# EAGLE design pic_can_x10 (EAGLE 6.5.0)
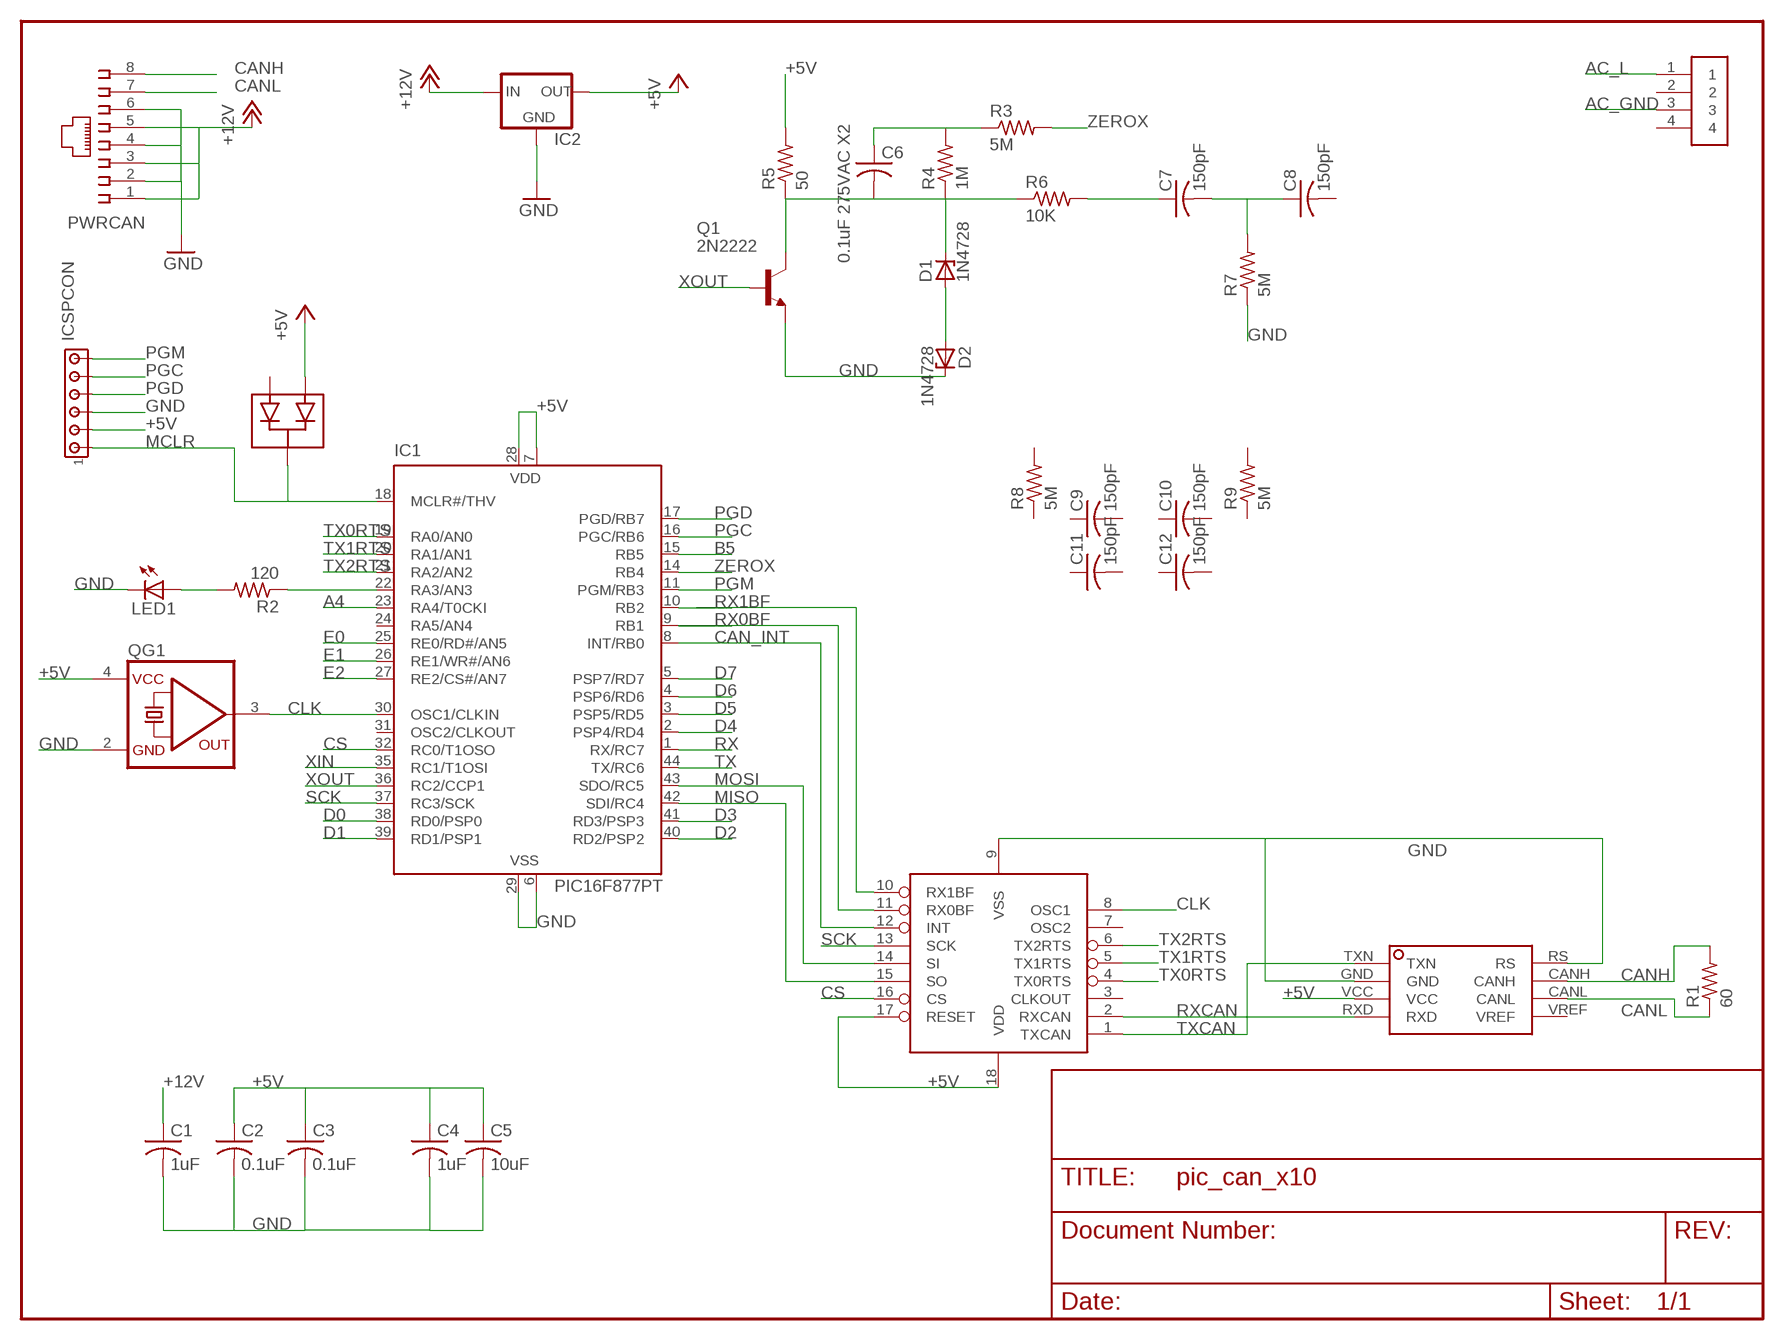
[diagram p0: schematic, sheet 1]

## Parts
C1  1uF  C-USC0805  [C0805]
C2  0.1uF  C-USC0805  [C0805]
C3  0.1uF  C-USC0805  [C0805]
C4  1uF  C-USC0805  [C0805]
C5  10uF  C-USC1206  [C1206]
C6  0.1uF 275VAC X2  C-USC0805  [C0805]
C7  150pF  C-USC0805  [C0805]
C8  150pF  C-USC0805  [C0805]
C9  150pF  C-USC0805  [C0805]
C10  150pF  C-USC0805  [C0805]
C11  150pF  C-USC0805  [C0805]
C12  150pF  C-USC0805  [C0805]
D1  1N4728  [DO41Z10]
D2  1N4728  [DO41Z10]
IC1  PIC16F877PT  [TQFP44]
IC2  78XXL  [78XXL]
IC3  UC5350D  [SOIC8]
ICSPCON  MTA06-100  [10X06MTA]
LED1  LEDCHIPLED_0805  [CHIPLED_0805]
MCP1  MCP2510-I/SO  [SO-18W]
PWRCAN  555166-1  [555166-1]
Q1  2N2222  [TO18]
QG1  SG531  [DIL08-4]
R1  60  R-US_R0805  [R0805]
R2  120  R-US_R0805  [R0805]
R3  5M  R-US_R0805  [R0805]
R4  1M  R-US_R0805  [R0805]
R5  50  R-US_R0805  [R0805]
R6  10K  R-US_R0805  [R0805]
R7  5M  R-US_R0805  [R0805]
R8  5M  R-US_R0805  [R0805]
R9  5M  R-US_R0805  [R0805]
U$1  MPT0.5/4-2.54"  [MPT0.5/4-2.54]
U$2  BAV70_  [SOT-23]

## Nets
+5V: C2.1 C3.1 C4.1 C5.1 IC1.7(VDD) IC1.28(VDD) IC2.OUT IC3.VCC ICSPCON.5 MCP1.17(RESET) MCP1.18(VDD) QG1.4(VCC) R5.2 U$2.1(A1)
+12V: C1.1 IC2.IN PWRCAN.1 PWRCAN.3 PWRCAN.5
A4: IC1.23(RA4/T0CKI)
AC_GND: U$1.3
AC_L: C6.1 R3.1 R4.2 U$1.1
B5: IC1.15(RB5)
CAN_INT: IC1.8(INT/RB0) MCP1.12(INT)
CANH: IC3.CANH PWRCAN.8 R1.2
CANL: IC3.CANL PWRCAN.7 R1.1
CLK: IC1.30(OSC1/CLKIN) MCP1.8(OSC1) QG1.3(OUT)
CS: IC1.32(RC0/T1OSO) MCP1.16(CS)
D0: IC1.38(RD0/PSP0)
D1: IC1.39(RD1/PSP1)
D2: IC1.40(RD2/PSP2)
D3: IC1.41(RD3/PSP3)
D4: IC1.2(PSP4/RD4)
D5: IC1.3(PSP5/RD5)
D6: IC1.4(PSP6/RD6)
D7: IC1.5(PSP7/RD7)
E0: IC1.25(RE0/RD#/AN5)
E1: IC1.26(RE1/WR#/AN6)
E2: IC1.27(RE2/CS#/AN7)
GND: C1.2 C2.2 C3.2 C4.2 C5.2 D2.C IC1.6(VSS) IC1.29(VSS) IC2.GND IC3.GND IC3.RS ICSPCON.4 LED1.C MCP1.9(VSS) PWRCAN.2 PWRCAN.4 PWRCAN.6 Q1.1(E) QG1.2(GND) R7.1
MCLR: IC1.18(MCLR#/THV) ICSPCON.6 U$2.3(C)
MISO: IC1.42(SDI/RC4) MCP1.15(SO)
MOSI: IC1.43(SDO/RC5) MCP1.14(SI)
N$1: LED1.A R2.2
N$2: C6.2 D1.C Q1.3(C) R4.1 R5.1 R6.1
N$3: IC1.22(RA3/AN3) R2.1
N$4: C7.1 R6.2
N$5: D1.A D2.A
N$6: C7.2 C8.1 R7.2
PGC: IC1.16(PGC/RB6) ICSPCON.2
PGD: IC1.17(PGD/RB7) ICSPCON.3
PGM: IC1.11(PGM/RB3) ICSPCON.1
RX: IC1.1(RX/RC7)
RX0BF: IC1.9(RB1) MCP1.11(RX0BF)
RX1BF: IC1.10(RB2) MCP1.10(RX1BF)
RXCAN: IC3.RXD MCP1.2(RXCAN)
SCK: IC1.37(RC3/SCK) MCP1.13(SCK)
TX: IC1.44(TX/RC6)
TX0RTS: IC1.19(RA0/AN0) MCP1.4(TX0RTS)
TX1RTS: IC1.20(RA1/AN1) MCP1.5(TX1RTS)
TX2RTS: IC1.21(RA2/AN2) MCP1.6(TX2RTS)
TXCAN: IC3.TXN MCP1.1(TXCAN)
XIN: IC1.35(RC1/T1OSI)
XOUT: IC1.36(RC2/CCP1) Q1.2(B)
ZEROX: IC1.14(RB4) R3.2
Unconnected: C8.2 C9.1 C9.2 C10.1 C10.2 C11.1 C11.2 C12.1 C12.2 IC1.24(RA5/AN4) IC1.31(OSC2/CLKOUT) IC3.VREF MCP1.3(CLKOUT) MCP1.7(OSC2) R8.1 R8.2 R9.1 R9.2 U$1.2 U$1.4 U$2.2(A2)

## Library data of the parts
C1-C12 = rcl:C-US: CAPACITOR, American symbol
D1 D2 = diode:1N4728: Z DIODE 3.3 V, 1W, 5 percent
IC1 = microchip:PIC16F87*: MICROCONTROLLER
IC2 = v-reg:78XXL: VOLTAGE REGULATOR
IC3 = house:UC5350: CAN Tranceiver
ICSPCON = con-amp:MTA06-100: AMP CONNECTOR
LED1 = led:LED: LED OSRAM: - CHIPLED LG R971, LG N971, LY N971, LG Q971, LY Q971, LO R971, LY R971 LH N974, LH R974 LS Q976, LO Q976, LY Q976 LO Q996 - Hyper CHIPLED LW Q18S LB Q993, LB Q99A, LB R99A - SideLED LS A670, LO A670, LY A670, LG A670, LP A670 LB A673, LV A673, LT A673, LW A673 LH A674 LY A675 LS A676, LA A676, LO A676, LY A676, LW A676 LS A679, LY A679, LG A679 - Hyper Micro SIDELED® LS Y876, LA Y876, LO Y876, LY Y876 LT Y87S - SmartLED LW L88C, LW L88S LB L89C, LB L89S, LG L890 LS L89K, LO L89K, LY L89K LS L896, LA L896, LO L896, LY L896 - TOPLED LS T670, LO T670, LY T670, LG T670, LP T670 LSG T670, LSP T670, LSY T670, LOP T670, LYG T670 LG T671, LOG T671, LSG T671 LB T673, LV T673, LT T673, LW T673 LH T674 LS T676, LA T676, LO T676, LY T676, LB T676, LH T676, LSB T676, LW T676 LB T67C, LV T67C, LT T67C, LS T67K, LO T67K, LY T67K, LW E67C LS E67B, LA E67B, LO E67B, LY E67B, LB E67C, LV E67C, LT E67C LW T67C LS T679, LY T679, LG T679 LS T770, LO T770, LY T770, LG T770, LP T770 LB T773, LV T773, LT T773, LW T773 LH T774 LS E675, LA E675, LY E675, LS T675 LS T776, LA T776, LO T776, LY T776, LB T776 LHGB T686 LT T68C, LB T68C - Hyper Mini TOPLED® LB M676 - Mini TOPLED Santana® LG M470 LS M47K, LO M47K, LY M47K Source: http://www.osram.convergy.de/
MCP1 = microchip:MCP2510
PWRCAN = con-amp:555166-1: AMP connector
Q1 = transistor-npn:2N2222*: NPN Transistor
QG1 = crystal:SG531: CRYSTAL RESONATOR
R1-R9 = rcl:R-US_: RESISTOR, American symbol
U$1 = house:MPT0.5/4-2.54: Pheonix Contact Micro-Pitch Terminal Block
U$2 = house:BAV70: Fairchild Semiconductor Small Signal, Dual, Common Cathode, SOT-23 Diode

## Board
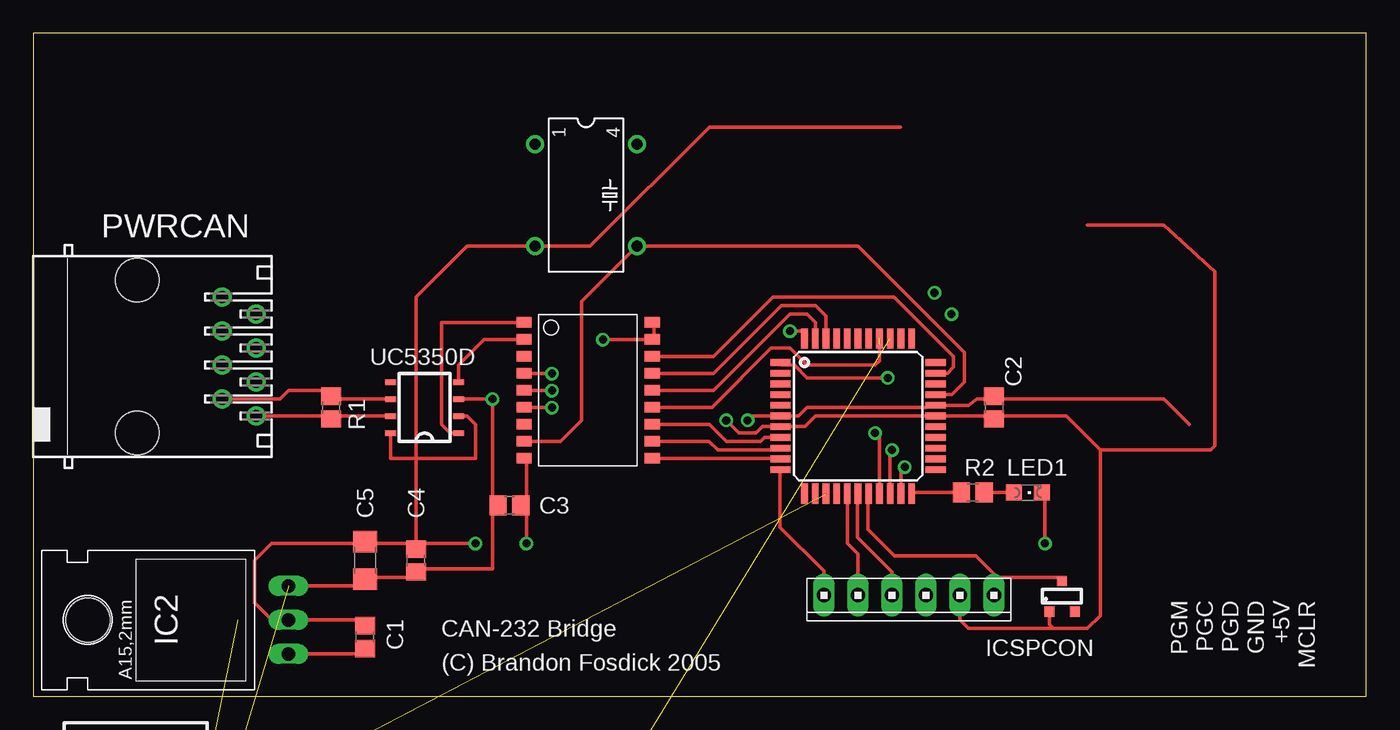
[diagram p1: board, top side]
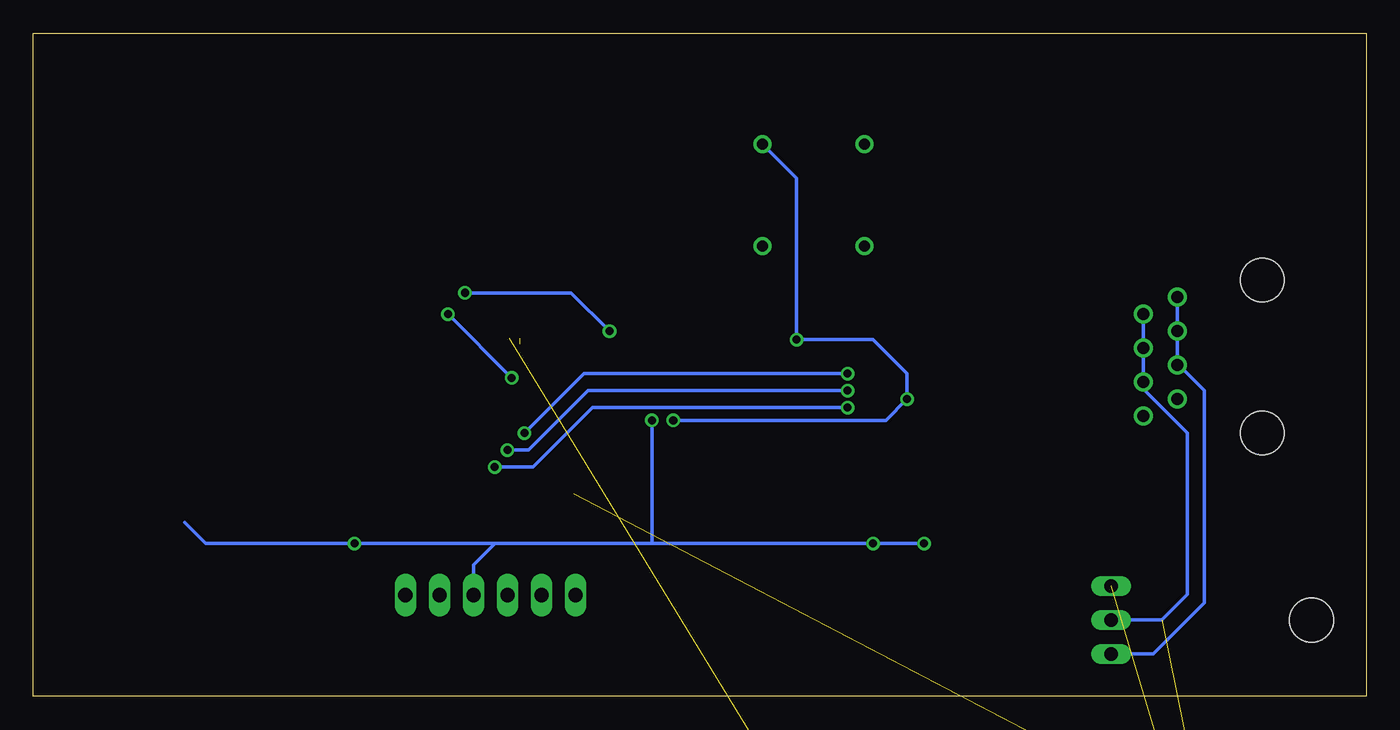
[diagram p2: board, bottom side, seen from below]

Size 99.55 x 49.55 mm. Coordinates in mm from the lower left corner, seen from the top.
Outline: 0,0 99.55,0 99.55,49.55 0,49.55 0,0
Copper layers (1*16): Top 0.035mm / dielectric 1.5mm / Bottom 0.035mm
Design rules "default": minimum track width 7mil, minimum drill 15mil, track to track 8mil, track to pad 8mil, pad to pad 8mil, via to via 8mil, smd to smd 8mil, copper to edge 40mil, drill to drill 20mil, minimum pad ring 10mil, minimum via ring 8mil, stop-mask expansion 0mil, vias tented up to drill 0mil, thermal gap 10mil

### Footprints (pad centres in the part's own frame; a part is rotated, then mirrored left to right if it is on the bottom)
C0805 = smd 1.3 x 1.5: 1 -0.85,0; 2 0.85,0
C1206 = smd 1.6 x 1.8: 1 -1.4,0; 2 1.4,0
DO41Z10 = drill 1.118: A 5.08,0; C -5.08,0
TQFP44 = smd 1.5 x 0.5: 1 -5.8,4; 2 -5.8,3.2; 3 -5.8,2.4; 4 -5.8,1.6; 5 -5.8,0.8; 6 -5.8,0; 7 -5.8,-0.8; 8 -5.8,-1.6; 9 -5.8,-2.4; 10 -5.8,-3.2; 11 -5.8,-4; 23 5.8,-4; 24 5.8,-3.2; 25 5.8,-2.4; 26 5.8,-1.6; 27 5.8,-0.8; 28 5.8,0; 29 5.8,0.8; 30 5.8,1.6; 31 5.8,2.4; 32 5.8,3.2; 33 5.8,4 | smd 0.5 x 1.5: 12 -4,-5.8; 13 -3.2,-5.8; 14 -2.4,-5.8; 15 -1.6,-5.8; 16 -0.8,-5.8; 17 0,-5.8; 18 0.8,-5.8; 19 1.6,-5.8; 20 2.4,-5.8; 21 3.2,-5.8; 22 4,-5.8; 34 4,5.8; 35 3.2,5.8; 36 2.4,5.8; 37 1.6,5.8; 38 0.8,5.8; 39 0,5.8; 40 -0.8,5.8; 41 -1.6,5.8; 42 -2.4,5.8; 43 -3.2,5.8; 44 -4,5.8
78XXL = drill 1 long: GND 0,-3.81; IN -2.54,-3.81; OUT 2.54,-3.81 | hole 3.302: 0,11.176
SOIC8 = smd 0.813 x 0.406: CANH 2.54,1.27; CANL 2.54,0; GND -2.54,1.27; RS 2.54,2.54; RXD -2.54,-1.27; TXN -2.54,2.54; VCC -2.54,0; VREF 2.54,-1.27
10X06MTA = drill 1.067 long: 1 6.35,0; 2 3.81,0; 3 1.27,0; 4 -1.27,0; 5 -3.81,0; 6 -6.35,0
CHIPLED_0805 = smd 1.2 x 1.2: A 0,-1.05; C 0,1.05
SO-18W = smd 0.762 x 1.143: 1 -5.08,-4.788; 2 -3.81,-4.788; 3 -2.54,-4.788; 4 -1.27,-4.788; 5 0,-4.788; 6 1.27,-4.788; 7 2.54,-4.788; 8 3.81,-4.788; 9 5.08,-4.788; 10 5.08,4.788; 11 3.81,4.788; 12 2.54,4.788; 13 1.27,4.788; 14 0,4.788; 15 -1.27,4.788; 16 -2.54,4.788; 17 -3.81,4.788; 18 -5.08,4.788
555166-1 = drill 0.889: 1 -4.445,5.207; 2 -3.175,7.747; 3 -1.905,5.207; 4 -0.635,7.747; 5 0.635,5.207; 6 1.905,7.747; 7 3.175,5.207; 8 4.445,7.747 | hole 3.251: -5.715,-1.143; 5.715,-1.143
TO18 = drill 0.813 octagon: 1 -1.27,-1.27; 2 1.27,-1.27; 3 1.27,1.27
DIL08-4 = drill 0.813: 1 -3.81,-3.81; 2 3.81,-3.81; 3 3.81,3.81; 4 -3.81,3.81
R0805 = smd 1.3 x 1.5: 1 -0.85,0; 2 0.85,0
MPT0.5/4-2.54 = drill 0.9: 1 -5.08,0; 2 -2.54,0; 3 0,0; 4 2.54,0
SOT-23 = smd 0.76 x 0.76: 1 -0.95,0; 2 0.95,0; 3 0,2.29

### Placement (x,y rotation side)
C1  24.77,4.45 90 top
C2  71.75,21.59 90 top
C3  35.56,14.29 0 top
C4  28.57,10.16 90 top
C5  24.77,10.16 90 top
C6  5.08,-27.94 0 top  (outside the outline)
C7  5.08,-88.9 0 top  (outside the outline)
C8  5.08,-96.52 0 top  (outside the outline)
C9  5.08,-119.38 0 top  (outside the outline)
C10  5.08,-127 0 top  (outside the outline)
C11  5.08,-134.62 0 top  (outside the outline)
C12  5.08,-142.24 0 top  (outside the outline)
D1  8.89,-43.18 0 top  (outside the outline)
D2  8.89,-50.8 0 top  (outside the outline)
IC1  61.59,20.95 0 top
IC2  15.24,5.71 90 top
IC3  29.21,22.23 180 top
ICSPCON  65.41,7.57 180 top
LED1  74.3,15.24 270 top
MCP1  41.43,22.88 270 top
PWRCAN  8.89,25.4 270 top
Q1  7.62,-62.23 0 top  (outside the outline)
QG1  41.27,37.47 270 top
R1  22.23,21.59 270 top
R2  70.17,15.24 0 top
R3  5.08,-12.7 0 top  (outside the outline)
R4  5.08,-20.32 0 top  (outside the outline)
R5  5.08,-35.56 0 top  (outside the outline)
R6  5.08,-73.66 0 top  (outside the outline)
R7  5.08,-81.28 0 top  (outside the outline)
R8  5.08,-104.14 0 top  (outside the outline)
R9  5.08,-111.76 0 top  (outside the outline)
U$1  8.89,-5.08 0 top  (outside the outline)
U$2  76.83,6.35 0 top

### Tracks (layer width: path | path; a pad name or v marks a point on that pad's centre or on a via)
+5V  (via drill 0.6)  (1 unrouted)
  Top 0.254: IC2.OUT 24.77,8.26 C5.1 24.77,8.89 28.57,8.89 C4.1 29.21,9.53 34.29,9.53 34.29,13.97 34.61,14.29 | 71.12,20.95 IC1.28 58.42,20.95 57.63,20.17 56.52,20.17 IC1.7 55.8,20.09 55.88,20.16 56.03,20.16 56.04,20.16 54.45,20.16 53.98,19.68 52.7,19.68 v51.75,20.64 | 71.12,20.95 C2.1 | IC3.VCC v34.29,22.23 34.29,14.61 34.61,14.29 | 46.35,26.67 46.35,27.94 MCP1.18 | 46.35,26.67 MCP1.17 45.72,26.67 | 71.12,20.95 77.15,20.95 79.69,18.41 | 78.74,35.24 84.45,35.24 88.27,31.75 88.27,18.73 87.95,18.41 79.69,18.41 | v42.55,26.67 46.35,26.67 | 34.61,14.29 C3.1 | U$2.1 75.81,6.28 U$2.1 75.88,5.4 76.2,5.08 | 69.22,7.62 ICSPCON.5 69.22,5.71 69.85,5.08 76.2,5.08 | 76.2,5.08 78.74,5.08 79.69,6.03 79.69,18.41
  Bottom 0.254: QG1.4 42.55,38.73 v42.55,26.67 36.83,26.67 34.29,24.13 v34.29,22.23 35.88,20.64 v51.75,20.64
+12V
  Top 0.254: C1.1 24.77,3.17 IC2.IN
  Bottom 0.254: IC2.IN 15.88,3.17 12.06,6.99 12.06,22.86 13.97,24.77 PWRCAN.5 14.1,27.18 13.97,27.3 PWRCAN.3 14.1,29.72 13.97,29.84 PWRCAN.1
AC_L  (3 unrouted)
CAN_INT
  Top 0.254: MCP1.12 46.24,20.32 50.48,20.32 51.75,19.05 54.29,19.05 54.61,19.37 55.81,19.37 | 55.81,19.37 55.88,19.37 | 55.81,19.37 IC1.8
CANH
  Top 0.254: PWRCAN.8 22.23,20.95 | 22.23,20.95 R1.2 | 22.23,20.95 IC3.CANH
CANL
  Top 0.254: PWRCAN.7 14.55,22.28 14.61,22.23 18.41,22.23 19.05,22.86 21.59,22.86 R1.1 22.48,22.23 IC3.CANL
CLK
  Top 0.254: MCP1.8 36.83,19.05 39.37,19.05 40.96,20.64 40.96,29.53 QG1.3 61.59,33.66 69.53,25.72 69.53,23.5 68.59,22.55 IC1.30
CS
  Top 0.254: MCP1.16 46.35,25.4 50.8,25.4 55.24,29.84 64.29,29.84 68.74,25.4 68.74,24.61 68.26,24.13 67.31,24.13 67.33,24.16 IC1.32
GND  (via drill 0.6)  (3 unrouted)
  Top 0.254: C1.2 24.77,5.71 IC2.GND 17.78,5.71 16.51,6.99 16.51,10.16 17.78,11.43 24.77,11.43 | 24.77,11.43 C5.2 | 28.57,11.43 C4.2 | 24.77,11.43 28.57,11.43 | IC3.RS 26.67,17.78 28.57,17.78 | 55.88,20.95 IC1.6 | 55.88,20.95 57.15,20.95 57.78,21.59 66.67,21.59 IC1.29 67.94,21.74 69.85,21.74 70.48,22.23 71.12,22.23 C2.2 72.39,22.23 84.45,22.23 86.36,20.32 | 64.77,42.55 61.28,42.55 50.48,42.55 41.59,33.66 QG1.2 32.38,33.66 28.57,29.84 28.57,17.78 | IC3.GND 32.38,20.95 33.02,20.32 33.02,17.78 28.57,17.78 | 28.57,11.43 v33.02,11.43 | 28.57,11.43 28.57,17.78 | v36.83,11.43 36.83,14.29 C3.2 36.83,14.71 36.83,17.78 36.67,17.78 MCP1.9 | 55.88,20.95 53.66,20.95 v53.34,20.64 | LED1.C 75.25,15.24 75.56,14.92 v75.56,11.43
  Bottom 0.254: PWRCAN.2 16.51,28.57 16.64,28.45 PWRCAN.4 16.51,26.04 16.64,25.91 PWRCAN.6 16.51,23.5 16.51,22.86 13.34,19.68 13.34,7.62 15.24,5.71 IC2.GND | v33.02,11.43 v36.83,11.43 53.34,11.43 | 53.34,11.43 65.08,11.43 | 65.08,11.43 v75.56,11.43 86.68,11.43 88.27,13.02 | ICSPCON.4 66.67,9.83 65.08,11.43 | 53.34,11.43 v53.34,20.64
MCLR
  Top 0.254: 62.38,15.39 IC1.18 62.33,15.09 62.33,12.5 64.31,10.52 70.41,10.52 71.75,9.17 71.75,8.89 | 71.75,7.49 ICSPCON.6 | 71.75,8.57 71.75,7.49 | 71.75,7.49 71.78,7.47 | 71.75,8.57 71.76,8.56 | 71.75,8.89 71.75,8.57 | 71.75,8.89 76.52,8.89 76.83,8.57 U$2.3
MISO
  Top 0.254: MCP1.15 46.35,24.13 50.8,24.13 55.88,29.21 58.42,29.21 59.21,28.42 59.21,27.15 IC1.42
MOSI
  Top 0.254: MCP1.14 46.35,22.86 50.8,22.86 56.52,28.57 57.78,28.57 58.42,27.94 58.42,27.3 IC1.43
N$1
  Top 0.254: LED1.A R2.2
N$2  (5 unrouted)
N$3
  Top 0.254: IC1.22 65.64,15.15 65.72,15.24 R2.1
N$4  (1 unrouted)
N$5  (1 unrouted)
N$6  (2 unrouted)
PGC
  Top 0.254: ICSPCON.2 61.59,10.64 60.81,11.43 60.81,15.09
  Top 0.406: 60.81,15.09 60.8,15.1 IC1.16
PGD
  Top 0.254: 61.59,15.24 IC1.17 61.59,14.96 61.57,14.94 61.57,11.89 64.14,9.32 ICSPCON.3
PGM
  Top 0.254: ICSPCON.1 59.05,9.37 55.78,12.65 55.78,16.92 55.8,16.93 IC1.11
  Top 0.406: IC1.11 55.78,16.94
RX  (via drill 0.6, 0.61)
  Top 0.254: v63.82,23.81 57.78,23.81 56.83,24.77 55.88,24.77 55.8,24.85 IC1.1
  Bottom 0.254: v63.82,23.81 v68.58,28.57
RX0BF
  Top 0.254: MCP1.11 50.46,19.07 51.12,18.41 55.88,18.41 55.8,18.5 IC1.9
RX1BF
  Top 0.254: IC1.10 55.85,17.75 55.88,17.78 55.86,17.8 MCP1.10
RXCAN
  Top 0.254: MCP1.2 36.2,26.67 33.66,26.67 31.75,24.77 IC3.RXD
SCK  (1 unrouted)
  Top 0.254: 63.2,26.36 63.18,26.35 63.18,25.08 62.87,24.77 57.78,24.77 56.52,26.04 55.09,26.04 50.67,21.61 MCP1.13
TX  (via drill 0.61)
  Top 0.254: v56.52,27.3 57.47,27.3 57.47,26.99 57.59,26.86 IC1.44
  Bottom 0.254: v56.52,27.3 59.37,30.16 v67.31,30.16
TX0RTS  (via drill 0.6)
  Top 0.254: MCP1.4 v38.73,24.13 | IC1.19 63.2,19.36 v62.87,19.68
  Bottom 0.254: v38.73,24.13 58.42,24.13 v62.87,19.68
TX1RTS  (via drill 0.6)
  Top 0.254: MCP1.5 v38.73,22.86 | IC1.20 63.99,18.24 v64.14,18.41
  Bottom 0.254: v38.73,22.86 58.1,22.86 62.55,18.41 v64.14,18.41
TX2RTS  (via drill 0.6)
  Top 0.254: MCP1.6 v38.73,21.59 | IC1.21 64.8,17.12 v65.09,17.14
  Bottom 0.254: v38.73,21.59 57.78,21.59 62.23,17.14 v65.09,17.14
TXCAN
  Top 0.254: MCP1.1 36.2,27.94 30.48,27.94 30.48,20.32 31.11,19.68 IC3.TXN
XOUT  (1 unrouted)
ZEROX  (1 unrouted)

### Text on the board
tNames: PGM | PGC | PGD | GND | +5V | MCLR | CAN-232 Bridge | (C) Brandon Fosdick 2005
tStop: 29 tStop
bStop: 30 bStop